# Altium schematic sheet booster_sheet.SchDoc
size A3; Organization: Altium Limited; Address1: L3, 12a Rodborough Rd; Address2: Frenchs Forest; Address3: NSW; Address4: Australia 2086; SheetNumber: 1; SheetTotal: 1
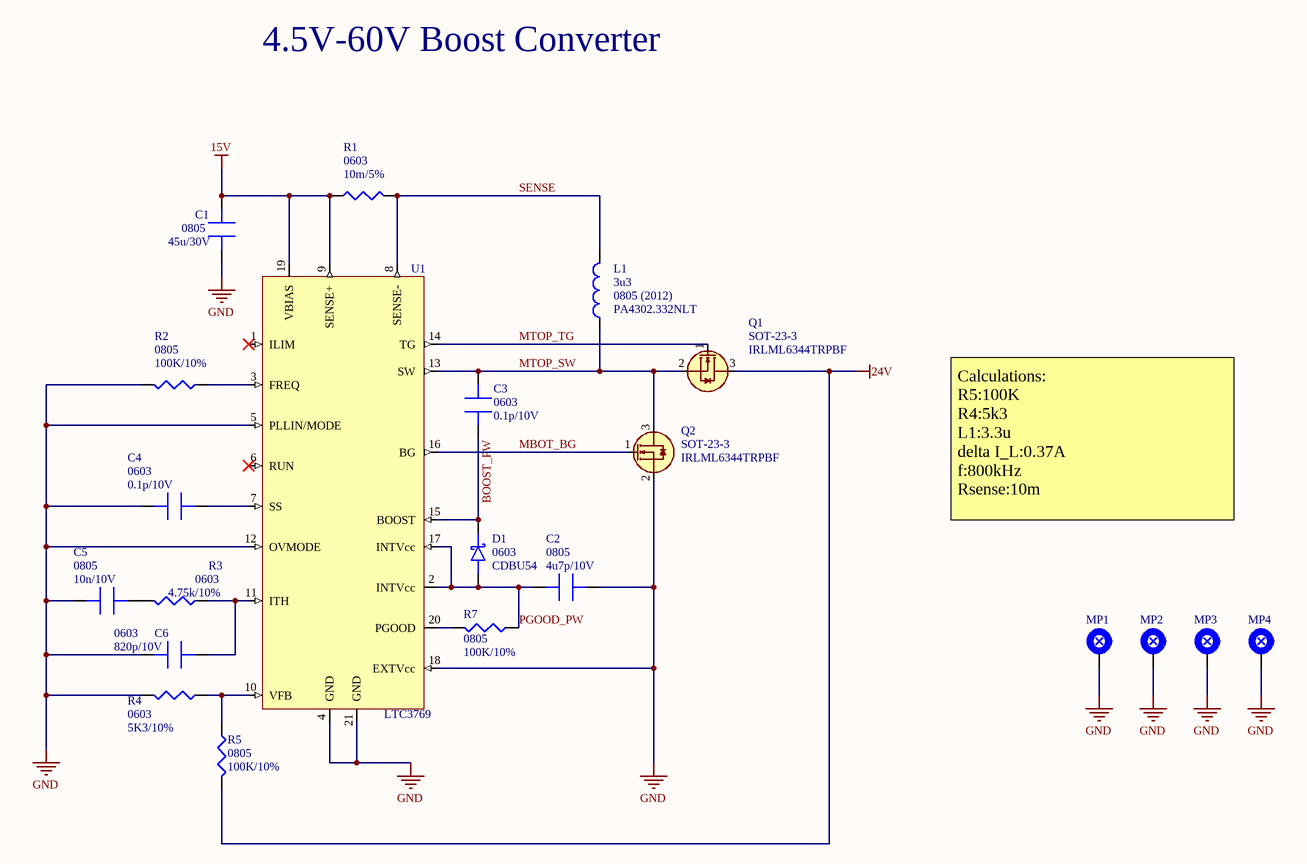
[diagram p0: booster_sheet.SchDoc]

## Parts
C1  value 45u/30V  Package: 0805  [CAPC2012X09L [0805]]  (hidden comment: C)
C2  value 4u7p/10V  Package: 0805  [CAPC2012X09L [0805]]  (hidden comment: C)
C3  value 0.1p/10V  Package: 0603  [CAPC1608X10L [0603]]  (hidden comment: C)
C4  value 0.1p/10V  Package: 0603  [CAPC1608X10L [0603]]  (hidden comment: C)
C5  value 10n/10V  Package: 0805  [CAPC2012X09L [0805]]  (hidden comment: C)
C6  value 820p/10V  Package: 0603  [CAPC1608X10L [0603]]  (hidden comment: C)
D1  Package: 0603  [DIOC1709X10N]  (hidden comment: CDBU54)
L1  value 3u3  Package: 0805 (2012)  [INDP7474X56N]  (hidden comment: PA4302.332NLT)
MP1  Mounting hole  [Mounting_hole_M3]  (value not drawn)
MP2  Mounting hole  [Mounting_hole_M3]  (value not drawn)
MP3  Mounting hole  [Mounting_hole_M3]  (value not drawn)
MP4  Mounting hole  [Mounting_hole_M3]  (value not drawn)
Q1  Package: SOT-23-3  [SOT95P237X120-3N]  (hidden comment: IRLML6344TRPBF)
Q2  Package: SOT-23-3  [SOT95P237X120-3N]  (hidden comment: IRLML6344TRPBF)
R1  value 10m/5%  Package: 0603  [RESC1608X05L [0603]]  (hidden comment: R)
R2  value 100K/10%  Package: 0805  [RESC2012X05L [0805]]  (hidden comment: R)
R3  value 4.75k/10%  Package: 0603  [RESC1608X05L [0603]]  (hidden comment: R)
R4  value 5K3/10%  Package: 0603  [RESC1608X05L [0603]]  (hidden comment: R)
R5  value 100K/10%  Package: 0805  [RESC2012X05L [0805]]  (hidden comment: R)
R7  value 100K/10%  Package: 0805  [RESC2012X05L [0805]]  (hidden comment: R)
U1  LTC3769  [LT3769FE]

## Nets
15V: C1.2 R1.2 U1.9(SENSE+) U1.19(VBIAS)
24V: Q1.3 R5.1
GND: C1.1 C2.1 C4.1 C5.1 C6.1 MP1.1 MP2.1 MP3.1 MP4.1 Q2.2 R2.1 R4.1 U1.4(GND) U1.5(PLLIN/MODE) U1.12(OVMODE) U1.18(EXTVcc) U1.21(GND)
BOOST_PW: C3.1 D1.1 U1.15(BOOST)
MBOT_BG: Q2.1 U1.16(BG)
MTOP_SW: C3.2 L1.1 Q1.2 Q2.3 U1.13(SW)
MTOP_TG: Q1.1 U1.14(TG)
PGOOD_PW: C2.2 D1.2 R7.2 U1.2(INTVcc) U1.17(INTVcc)
SENSE: L1.2 R1.1 U1.8(SENSE-)
NetC4_2: C4.2 U1.7(SS)
NetC5_2: C5.2 R3.1
NetC6_2: C6.2 R3.2 U1.11(ITH)
NetR2_2: R2.2 U1.3(FREQ)
NetR4_2: R4.2 R5.2 U1.10(VFB)
NetR7_1: R7.1 U1.20(PGOOD)

Not connected (* = marked no-connect by the designer): U1 1(ILIM)* 6(RUN)*

## Notes on the sheet
- 4.5V-60V Boost Converter
- Calculations:
  R5:100K
  R4:5k3
  L1:3.3u
  delta I_L:0.37A
  f:800kHz
  Rsense:10m
- TITLE:
- PROJECT:
- FILE NAME:
- DRAWN BY:
- CHECKED BY:
- DATE:
- SHEET NO.:
- PROJ. REV.:
- OF
- SHEET REV.:
- SIZE:
- A3

## Library data of the parts
C1-C6 = C: Standard capacitor
D1 = sSchottky: Schottky Diodes & Rectifiers VR=30V, IO=200mA; PN: CDBU54; HelpURL: https://eu.mouser.com/ProductDetail/Comchip-Technology/CDBU54?qs=2qJf6qQ4IOILsV4GWiwJOA%3D%3D
L1 = Inductor: Fixed Inductors 3.3uH SMT Inductor 7.5 x 7.5 x 5.6mm; PN: PA4302.332NLT
Q1 Q2 = sN-MOSFET: MOSFET MOSFT 5.0A 29mOhm 30V 2.5V drv capable; HelpURL: https://eu.mouser.com/ProductDetail/Infineon-IR/IRLML6344TRPBF?qs=9%252BKlkBgLFf2w4qS48UOXVw%3D%3D; PN: IRLML6344TRPBF
R1-R5 R7 = R: Standard resistor
U1 = Booster: Switching Voltage Regulators 60V Low IQ Synchronous Boost Controller; HelpURL: https://eu.mouser.com/ProductDetail/Analog-Devices/LTC3769EFEPBF?qs=hVkxg5c3xu%2FNYTxkJcj7gA%3D%3D; Package: (TSSOP)